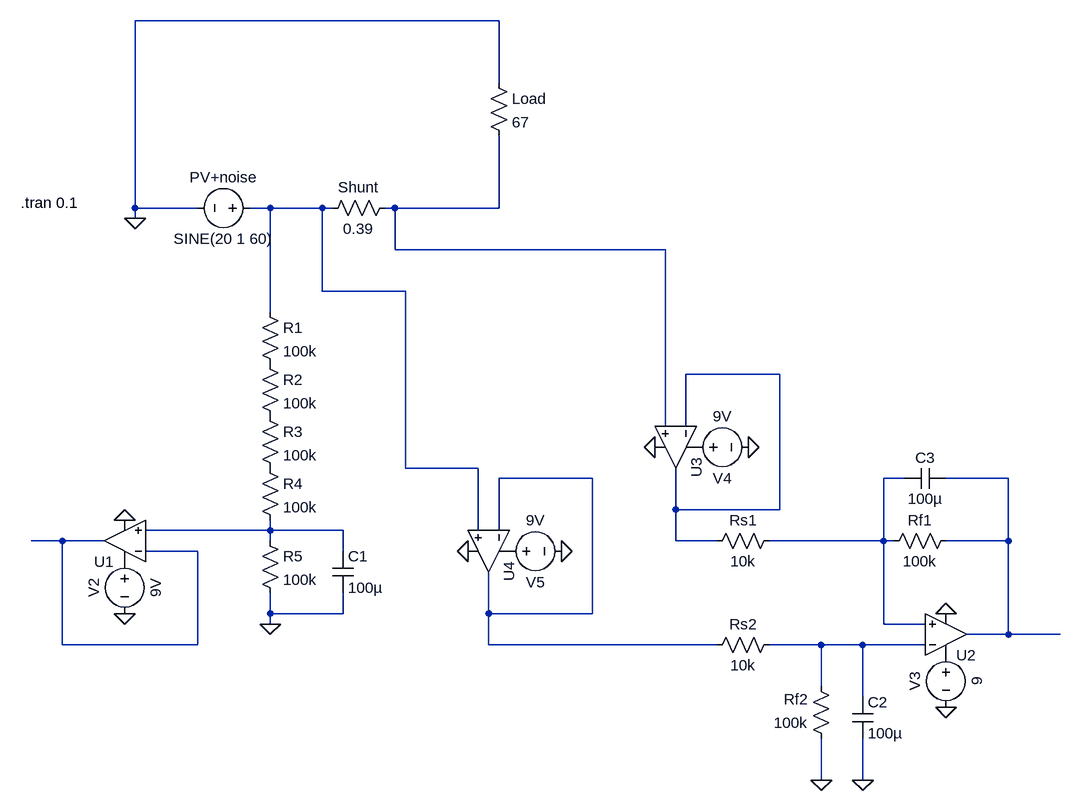
[diagram p0: schematic M_circuit.asc]
M_circuit.asc, the LTspice schematic file:
Version 4.1
SHEET 1 2436 1300
WIRE 448 -144 -112 -144
WIRE 448 -48 448 -144
WIRE -112 144 -112 -144
WIRE -16 144 -112 144
WIRE 96 144 64 144
WIRE 176 144 96 144
WIRE 192 144 176 144
WIRE 288 144 272 144
WIRE 448 144 448 32
WIRE 448 144 288 144
WIRE -112 160 -112 144
WIRE 288 208 288 144
WIRE 704 208 288 208
WIRE 176 272 176 144
WIRE 304 272 176 272
WIRE 96 304 96 144
WIRE 880 400 736 400
WIRE 704 480 704 208
WIRE 736 480 736 400
WIRE 304 544 304 272
WIRE 416 544 304 544
WIRE 592 560 448 560
WIRE 1072 560 1040 560
WIRE 1232 560 1136 560
WIRE 720 608 720 544
WIRE 880 608 880 400
WIRE 880 608 720 608
WIRE 96 640 96 624
WIRE 96 640 -96 640
WIRE 208 640 96 640
WIRE 416 640 416 544
WIRE 448 640 448 560
WIRE -224 656 -272 656
WIRE -160 656 -224 656
WIRE 96 656 96 640
WIRE 720 656 720 608
WIRE 784 656 720 656
WIRE 1040 656 1040 560
WIRE 1040 656 864 656
WIRE 1056 656 1040 656
WIRE 1232 656 1232 560
WIRE 1232 656 1136 656
WIRE -16 672 -96 672
WIRE 208 672 208 640
WIRE 96 768 96 736
WIRE 208 768 208 736
WIRE 208 768 96 768
WIRE 432 768 432 704
WIRE 592 768 592 560
WIRE 592 768 432 768
WIRE 96 784 96 768
WIRE 1040 784 1040 656
WIRE 1104 784 1040 784
WIRE 1232 800 1232 656
WIRE 1232 800 1168 800
WIRE 1312 800 1232 800
WIRE -224 816 -224 656
WIRE -16 816 -16 672
WIRE -16 816 -224 816
WIRE 432 816 432 768
WIRE 784 816 432 816
WIRE 944 816 864 816
WIRE 1008 816 944 816
WIRE 1104 816 1008 816
WIRE 944 880 944 816
WIRE 1008 896 1008 816
WIRE 944 1024 944 960
WIRE 1008 1024 1008 960
FLAG -112 160 0
FLAG 96 784 0
FLAG -128 768 0
FLAG -128 624 0
FLAG 1136 768 0
FLAG 1136 912 0
FLAG 944 1024 0
FLAG 832 512 0
FLAG 688 512 0
FLAG 544 672 0
FLAG 400 672 0
FLAG 1008 1024 0
SYMBOL voltage 80 144 R90
WINDOW 0 -32 56 VBottom 2
WINDOW 3 32 56 VTop 2
WINDOW 123 0 0 Left 0
WINDOW 39 0 0 Left 0
SYMATTR InstName PV+noise
SYMATTR Value SINE(20 1 60)
SYMBOL res 288 128 R90
WINDOW 0 0 56 VBottom 2
WINDOW 3 32 56 VTop 2
SYMATTR InstName Shunt
SYMATTR Value 0.39
SYMBOL res 432 -64 R0
SYMATTR InstName Load
SYMATTR Value 67
SYMBOL res 80 288 R0
SYMATTR InstName R1
SYMATTR Value 100k
SYMBOL res 80 368 R0
SYMATTR InstName R2
SYMATTR Value 100k
SYMBOL res 80 448 R0
SYMATTR InstName R3
SYMATTR Value 100k
SYMBOL res 80 528 R0
SYMATTR InstName R4
SYMATTR Value 100k
SYMBOL res 80 640 R0
SYMATTR InstName R5
SYMATTR Value 100k
SYMBOL cap 192 672 R0
SYMATTR InstName C1
SYMATTR Value 100µ
SYMBOL voltage -128 672 R0
WINDOW 0 -32 56 VBottom 2
WINDOW 3 32 56 VTop 2
WINDOW 123 0 0 Left 0
WINDOW 39 0 0 Left 0
SYMATTR InstName V2
SYMATTR Value 9V
SYMBOL voltage 1136 816 M0
WINDOW 0 32 56 VTop 2
WINDOW 3 -32 56 VBottom 2
WINDOW 123 0 0 Left 0
WINDOW 39 0 0 Left 0
SYMATTR InstName V3
SYMATTR Value 9
SYMBOL res 880 640 R90
WINDOW 0 0 56 VBottom 2
WINDOW 3 32 56 VTop 2
SYMATTR InstName Rs1
SYMATTR Value 10k
SYMBOL res 1152 640 R90
WINDOW 0 0 56 VBottom 2
WINDOW 3 32 56 VTop 2
SYMATTR InstName Rf1
SYMATTR Value 100k
SYMBOL res 880 800 R90
WINDOW 0 0 56 VBottom 2
WINDOW 3 32 56 VTop 2
SYMATTR InstName Rs2
SYMATTR Value 10k
SYMBOL res 960 976 R180
WINDOW 0 36 76 Left 2
WINDOW 3 36 40 Left 2
SYMATTR InstName Rf2
SYMATTR Value 100k
SYMBOL OpAmps\\UniversalOpAmp 1136 800 M180
SYMATTR InstName U2
SYMBOL OpAmps\\UniversalOpAmp -128 656 R180
SYMATTR InstName U1
SYMBOL voltage 736 512 R270
WINDOW 0 -32 56 VBottom 2
WINDOW 3 32 56 VTop 2
WINDOW 123 0 0 Left 0
WINDOW 39 0 0 Left 0
SYMATTR InstName V4
SYMATTR Value 9V
SYMBOL OpAmps\\UniversalOpAmp 720 512 R90
SYMATTR InstName U3
SYMBOL voltage 448 672 R270
WINDOW 0 -32 56 VBottom 2
WINDOW 3 32 56 VTop 2
WINDOW 123 0 0 Left 0
WINDOW 39 0 0 Left 0
SYMATTR InstName V5
SYMATTR Value 9V
SYMBOL OpAmps\\UniversalOpAmp 432 672 R90
SYMATTR InstName U4
SYMBOL cap 992 896 R0
SYMATTR InstName C2
SYMATTR Value 100µ
SYMBOL cap 1136 544 R90
WINDOW 0 0 32 VBottom 2
WINDOW 3 32 32 VTop 2
SYMATTR InstName C3
SYMATTR Value 100µ
TEXT -288 136 Left 2 !.tran 0.1

The netlist it stands for:
* M_circuit.asc
V§PV+noise N001 0 SINE(20 1 60)
R§Shunt N002 N001 0.39
R§Load 0 N002 67
R1 N001 P001 100k
R2 P001 P002 100k
R3 P002 P003 100k
R4 P003 N007 100k
R5 N007 0 100k
C1 N007 0 100µ
V2 P004 0 9V
V3 P005 0 9
Rs1 N005 N003 10k
Rf1 N006 N005 100k
Rs2 N009 N004 10k
Rf2 0 N009 100k
X§U2 N005 N009 P005 0 N006 level1 Avol=1Meg GBW=10Meg Vos=0 En=0 Enk=0 In=0 Ink=0 Rin=500Meg  ; pins In+ In- V+ V- OUT
X§U1 N007 N008 P004 0 N008 level1 Avol=1Meg GBW=10Meg Vos=0 En=0 Enk=0 In=0 Ink=0 Rin=500Meg  ; pins In+ In- V+ V- OUT
V4 P006 0 9V
X§U3 N002 N003 P006 0 N003 level1 Avol=1Meg GBW=10Meg Vos=0 En=0 Enk=0 In=0 Ink=0 Rin=500Meg  ; pins In+ In- V+ V- OUT
V5 P007 0 9V
X§U4 N001 N004 P007 0 N004 level1 Avol=1Meg GBW=10Meg Vos=0 En=0 Enk=0 In=0 Ink=0 Rin=500Meg  ; pins In+ In- V+ V- OUT
C2 N009 0 100µ
C3 N006 N005 100µ
.tran 0.1
.lib UniversalOpAmp1.lib
.backanno
.end